# Altium schematic sheet Tone_Stack_V2.SchDoc
size A4
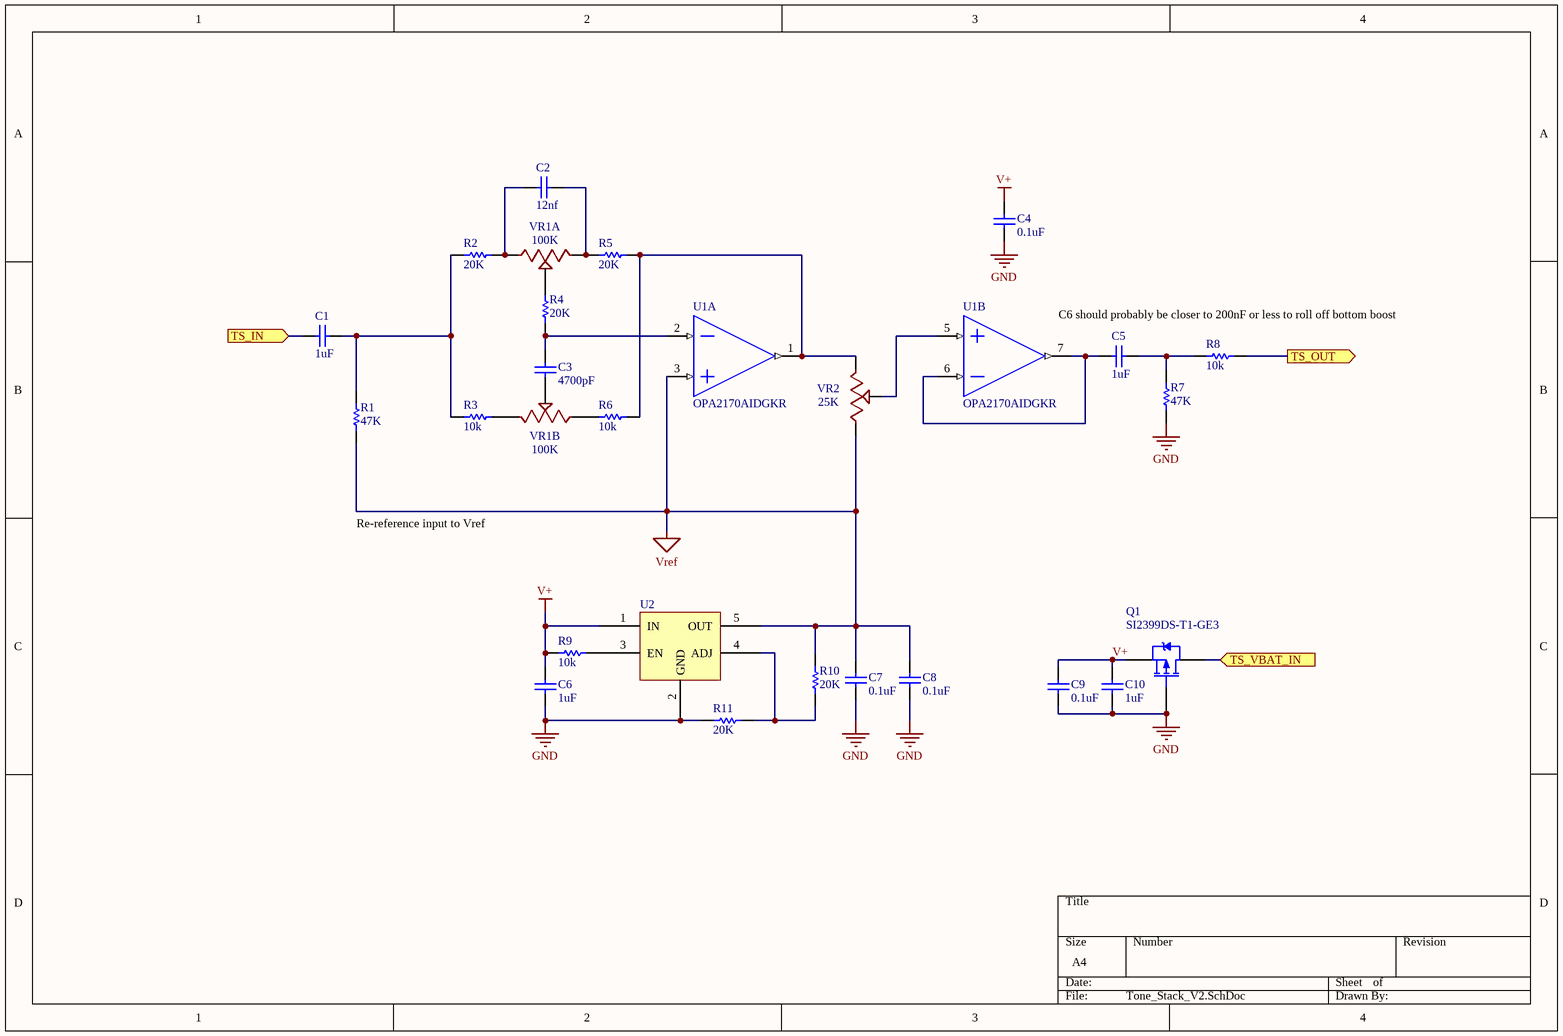
[diagram p0: Tone_Stack_V2.SchDoc]

## Parts
C1  1uF  [CAPC1608X09N]
C2  12nf  [CAPC1608X09N]
C3  4700pF  [CAPC1608X09N]
C4  0.1uF  [CAPC1608X09N]
C5  1uF  [CAPC1608X09N]
C6  1uF  [CAPC1608X09N]
C7  0.1uF  [CAPC1608X09N]
C8  0.1uF  [CAPC1608X09N]
C9  0.1uF  [CAPC1608X09N]
C10  1uF  [CAPC1608X09N]
J4  CONN RCPT 14POS SMD GOLD  [DF12(3.0)-14DS]  (value not drawn)  (parts B,C,D of 4)
Q1  SI2399DS-T1-GE3  [SOT95P237X112-3N]
R1  47K  [RESC1608X06N]
R2  20K  [RESC1608X06N]
R3  10k  [RESC1608X06N]
R4  20K  [RESC1608X06N]
R5  20K  [RESC1608X06N]
R6  10k  [RESC1608X06N]
R7  47K  [RESC1608X06N]
R8  10k  [RESC1608X06N]
R9  10k  [RESC1608X06N]
R10  20K  [RESC1608X06N]
R11  20K  [RESC1608X06N]
U1  OPA2170AIDGKR  [TSOP65P490X110-8N]  (parts A,B of 2)
U2  IC REG LIN POS ADJ 200MA SOT23-5  [SOT95P280X145-5N]  (value not drawn)

## Ports
TS_IN (in), TS_OUT (out), TS_VBAT_IN (in)

## Nets
GND: C4.1 C6.1 C7.1 C8.1 C9.1 C10.1 Q1.1(G) R7.1 R11.2 U1.4(V-) U2.2(GND)
V+: C4.2 C6.2 C9.2 C10.2 Q1.2(S) R9.1 U1.8(V+) U2.1(IN)
Vref: C7.2 C8.2 J4.7(B3) R1.1 R10.2 U1.3(+IN_A) U2.5(OUT)
TS_IN: C1.1 ; port TS_IN
TS_OUT: R8.2 ; port TS_OUT
TS_VBAT_IN: Q1.3(D) ; port TS_VBAT_IN
NetC1_2: C1.2 R1.2 R2.1 R3.1
NetC2_1: C2.1 J4.1(B1) R2.2
NetC2_2: C2.2 J4.8(A1) R5.1
NetC3_1: C3.1 J4.3(W2)
NetC3_2: C3.2 R4.1 U1.2(-IN_A)
NetC5_1: C5.1 U1.6(-IN_B) U1.7(OUT_B)
NetC5_2: C5.2 R7.2 R8.1
NetJ4_2: J4.2(A2) R3.2
NetJ4_4: J4.4(B2) R6.1
NetJ4_5: J4.5(A3) R5.2 R6.2 U1.1(Out_A)
NetJ4_6: J4.6(W3) U1.5(+IN_B)
NetJ4_9: J4.9(W1) R4.2
NetR9_2: R9.2 U2.3(EN)
NetR10_1: R10.1 R11.1 U2.4(ADJ)

## Notes on the sheet
- VR1A
- (near J4) 100K
- (near U1) C6 should probably be closer to 200nF or less to roll off bottom boost
- (near J4) VR1B
- (near J4) VR2
- (near J4) 25K
- Re-reference input to Vref

## Library data of the parts
C1 C5 C6 C10 = CAP CER 1UF 25V X7R 0603: 1µF ±10% 25V Ceramic Capacitor X7R 0603 (1608 Metric); Value: 1uF; Digikey Part Number: 490-10673-1-ND; Voltage: 25V; Rating: X7R; Tolerance: 10%; Package: 0603
C2 = CAP CER 0.012UF 25V C0G/NP0 0603: 0.012µF ±5% 25V Ceramic Capacitor C0G, NP0 0603 (1608 Metric); Manufacturer: Kemet; Digikey Part Number: 399-20390-1-ND; Value: 12nf; Rating: C0G/NP0; Tolerance: 5%; Voltage: 25V
C3 = CAP CER 4700PF 50V C0G/NP0 0603: 4700pF ±5% 50V Ceramic Capacitor C0G, NP0 0603 (1608 Metric); Manufacturer: Murata; Value: 4700pF; Digikey Part Number: 490-9669-1-ND; Voltage: 50V; Tolerance: 5%; Rating: C0G
C4 C7-C9 = CAP CER 0.1UF 50V X7R 0603: 0.1µF ±10% 50V Ceramic Capacitor X7R 0603 (1608 Metric); Value: 0.1uF; Digikey Part Number: 1276-CL10B104KB8NNNLCT-ND; Package: 0603; Voltage: 50V; Rating: X7R; Tolerance: 10%
J4 = DF12(3.0)-14DS-0.5V(86)-COMPOSITE: 14 Position Connector Header, Outer Shroud Contacts Surface Mount Gold; Manufacturer: Hirose; Digikey Part Number: H11702CT-ND
Q1 = MOSFET_P_CH_20V_6A_SOT23-3: Reverse Voltage MOSFET; Manufacturer: Vishay Siliconix; VDS: 20V; Rds On (Max): 34 mOhm @ 5.1A, 10V; Digikey Part Number: SI2399DS-T1-GE3CT-ND; Value: SI2399DS-T1-GE3
R1 R7 = RES SMD 47K OHM 1% 1/10W 0603: RES 47K 0603; Tolerance: 1%; Type: RES; Footprint: 0603; Value: 47K; Digikey Part Number: 311-47.0KHRCT-ND
R2 R4 R5 R10 R11 = RES SMD 20K OHM 1% 1/10W 0603: Footprint: 0603; Tolerance: 1%; Value: 20K; Digikey Part Number: 311-20.0KHRCT-ND; Type: RES
R3 R6 R8 R9 = RES SMD 10K OHM 1% 1/10W 0603: Manufacturer: Yageo; Manufacturer Part Number: RC0603FR-0710KL; Power: 0.1W; Type: RES; Footprint: 0603; Tolerance: 1%; Temperature: 155dC; Digikey Part Number: 311-10.0KHRCT-ND; Value: 10k
U1 = OPA2170AIDGKR: General Purpose Amplifier 2 Circuit Rail-to-Rail 8-VSSOP; Manufacturer: Texas Instruments; Amplifier: Low Power; Digikey Part Number: 296-36694-1-ND
U2 = LDK320AM-R: Linear Voltage Regulator IC 1 Output 200mA SOT-23-5; Manufacturer: STMicroelectronics; Voltage - Input (Max): 18V; Voltage Dropout (Max): 0.35V @ 200mA; Current - Quiescent (Iq): 90µA; Digikey Part Number: 497-16672-1-ND; Current - Output: 200mA